# EAGLE schematic SensorShield-Smoke (EAGLE 6.6.0)
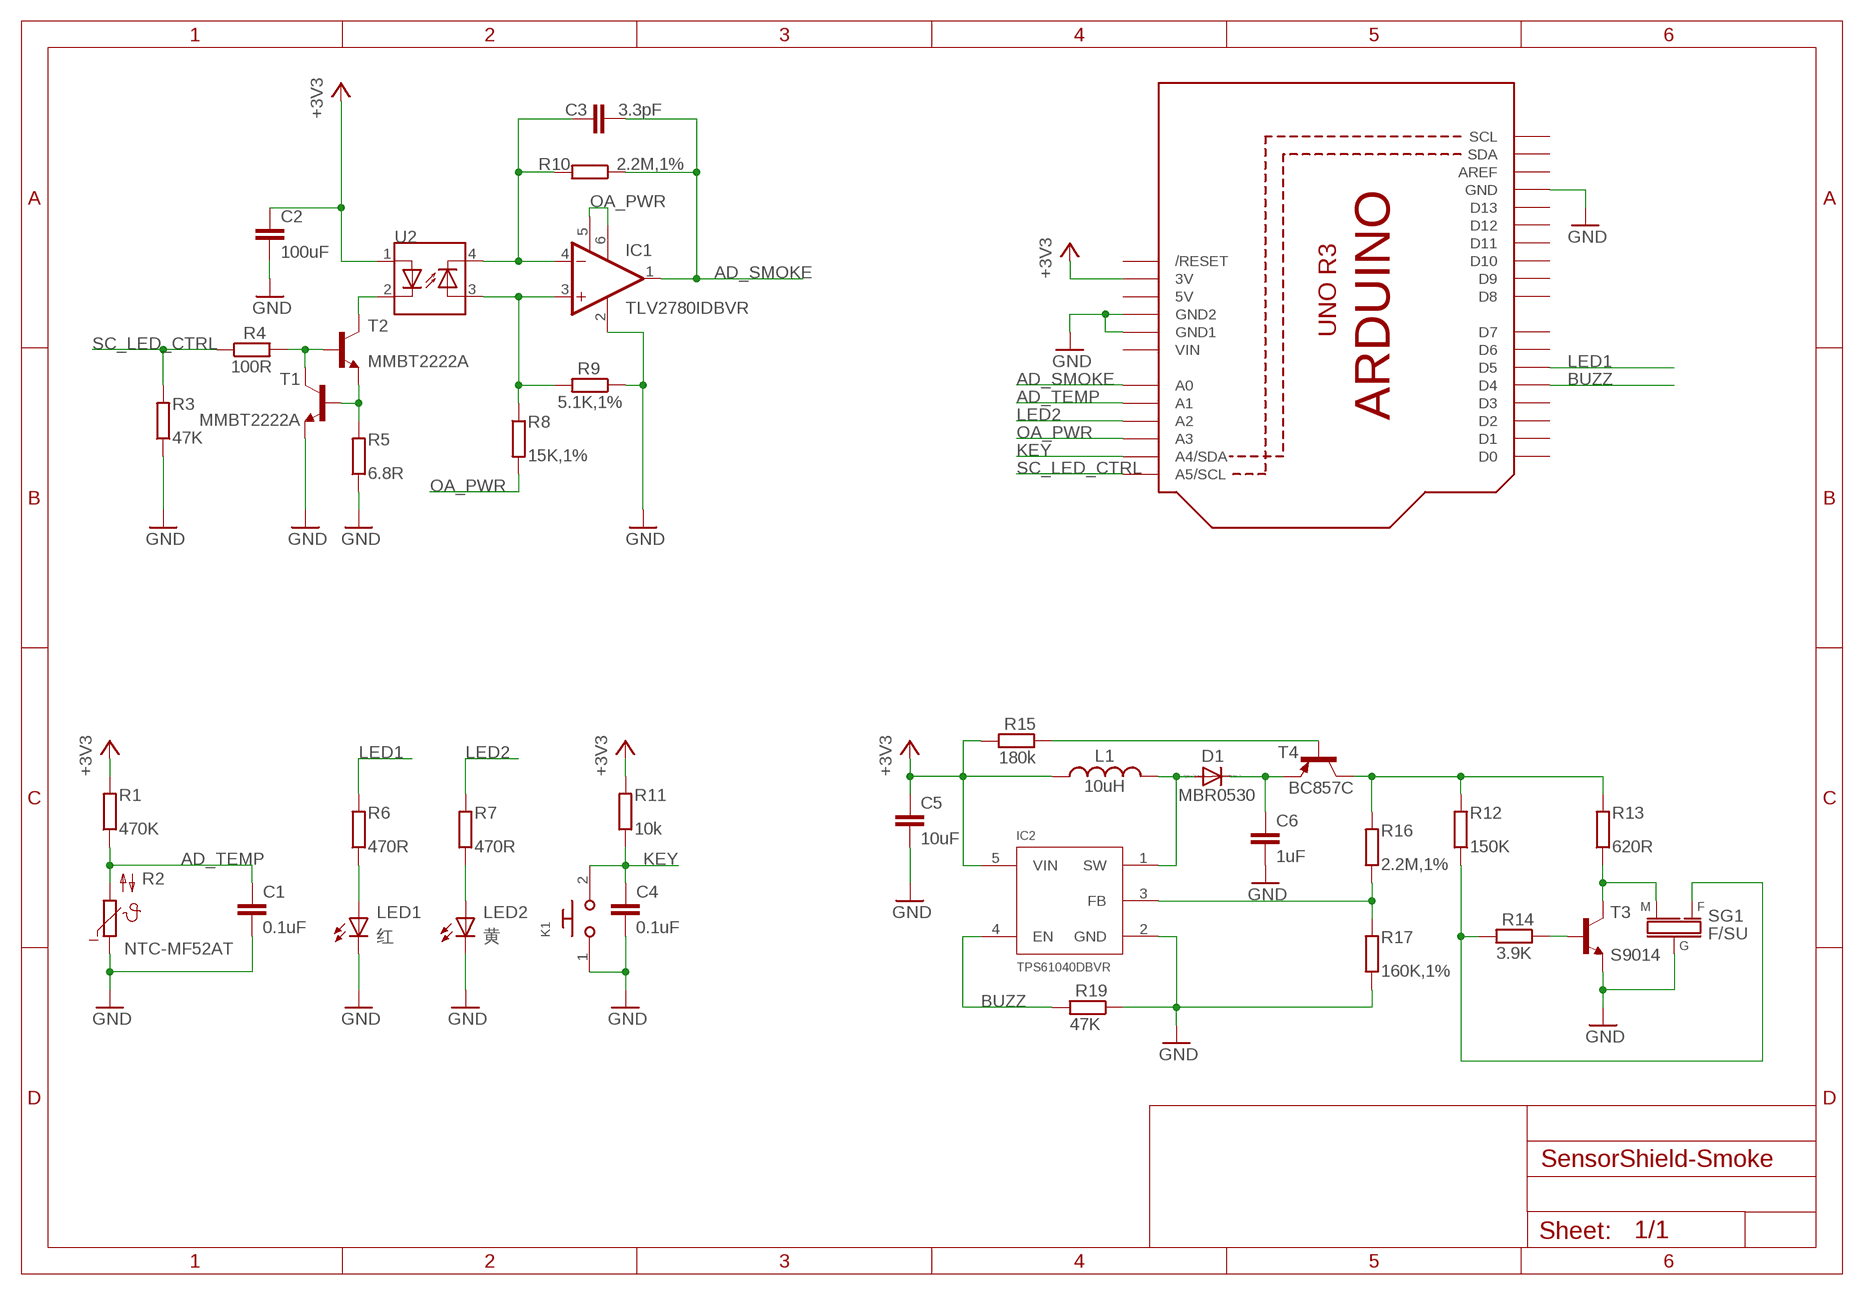
[diagram p0: schematic, sheet 1]

## Parts
C1  0.1uF  C-EUC0805  [C0805]
C2  100uF  C-EUC1210  [C1210]
C3  3.3pF  C-EUC0805  [C0805]
C4  0.1uF  C-EUC0805  [C0805]
C5  10uF  C-EUC0805  [C0805]
C6  1uF  C-EUC0805  [C0805]
D1  MBR0530  DIODE-SOD123  [SOD123]
IC1  TLV2780IDBVR  [SOT23-6]
IC2  TPS61040DBVR  [DBV0005A]
K1  MYLIBRARY_MICRO_SWITCH  [MYLIBRARY_MICROSWITCH]
L1  10uH  L-USL3216C  [L3216C]
LED1  红  LEDSML0805  [SML0805]
LED2  黄  LEDSML0805  [SML0805]
Q1  ARDUINOR3-NOIOREF-NOTEXT  [ARDUINOR3-NOTEXT-NOIOREF]
R1  470K  R-EU_R0805  [R0805]
R2  NTC-MF52AT  NTC640  [P640]
R3  47K  R-EU_R0805  [R0805]
R4  100R  R-EU_R0805  [R0805]
R5  6.8R  R-EU_R0805  [R0805]
R6  470R  R-EU_R0805  [R0805]
R7  470R  R-EU_R0805  [R0805]
R8  15K,1%  R-EU_R0805  [R0805]
R9  5.1K,1%  R-EU_R0805  [R0805]
R10  2.2M,1%  R-EU_R0805  [R0805]
R11  10k  R-EU_R0805  [R0805]
R12  150K  R-EU_R0805  [R0805]
R13  620R  R-EU_R0805  [R0805]
R14  3.9K  R-EU_R0805  [R0805]
R15  180k  R-EU_R0805  [R0805]
R16  2.2M,1%  R-EU_R0805  [R0805]
R17  160K,1%  R-EU_R0805  [R0805]
R19  47K  R-EU_R0805  [R0805]
SG1  F/SU  [F/SU]
T1  MMBT2222A  MMBT2222ALT1-NPN-SOT23-BEC  [SOT23-BEC]
T2  MMBT2222A  MMBT2222ALT1-NPN-SOT23-BEC  [SOT23-BEC]
T3  S9014  BC847C-NPN-SOT23-BEC  [SOT23-BEC]
T4  BC857C  BC857C-PNP-SOT23-BEC  [SOT23-BEC]
U2  SMOKE-CHAMBER6-131  [6-131]

## Nets
+3V3: C2.1 C5.1 IC2.5(VIN) L1.1 Q1.3V R1.2 R11.2 R15.2 U2.1(A)
AD_SMOKE: C3.1 IC1.1(OUT) Q1.A0 R10.1
AD_TEMP: C1.1 Q1.A1 R1.1 R2.2
BUZZ: IC2.4(EN) Q1.D4 R19.2
F: R12.1 R14.2 SG1.1(F)
GND: C1.2 C2.2 C4.2 C5.2 C6.2 IC1.2(V-) IC2.2(GND) K1.1 LED1.C LED2.C Q1.GND Q1.GND1 Q1.GND2 R2.1 R3.1 R5.1 R9.1 R17.1 R19.1 SG1.3(G) T1.E T3.E
KEY: C4.1 K1.2 Q1.A4(A4/SDA) R11.1
LED1: Q1.D5 R6.2
LED2: Q1.A2 R7.2
M: R13.1 SG1.2(M) T3.C
N$1: C3.2 IC1.4(-IN) R10.2 U2.4(C1)
N$2: IC1.3(+IN) R8.1 R9.2 U2.3(A1)
N$4: LED1.A R6.1
N$5: R4.2 T1.C T2.B
N$6: R5.2 T1.B T2.E
N$7: T2.C U2.2(C)
N$9: D1.A IC2.1(SW) L1.2
N$10: R14.1 T3.B
N$12: LED2.A R7.1
N$13: C6.1 D1.C T4.E
N$14: IC2.3(FB) R16.1 R17.2
N$15: R12.2 R13.2 R16.2 T4.C
N$16: R15.1 T4.B
OA_PWR: IC1.5(!SHDN) IC1.6(V+) Q1.A3 R8.2
SC_LED_CTRL: Q1.A5(A5/SCL) R3.2 R4.1
Unconnected: Q1.AREF Q1.D0 Q1.D1 Q1.D2 Q1.D3 Q1.D6 Q1.D7 Q1.D8 Q1.D9 Q1.D10 Q1.D11 Q1.D12 Q1.D13 Q1.RESET(/RESET) Q1.SCL Q1.SDA

## Power pins joined to a net without a drawn wire
5V: Q1.5V
VIN: Q1.VIN

## Library data of the parts
C1-C6 = rcl:C-EU: CAPACITOR, European symbol
D1 = diode:DIODE-: DIODE
IC1 = MyLibrary:TLV2780IDBVR: 具有关断状态的单路 1.8V RRIO 8MHz 放大器
IC2 = MyLibrary:TPS61040DBVR; COMPTYPE: IC; MANUFACTURER: Texas Instruments; MOUNTTYPE: SMT; PACKAGEREFERENCE: DBV0005A; PARTNUMBER: TPS61040DBVR; PIN_COUNT: 5; REFDES: RefDes; ROHS: Y; SYMBOLVERISON: 2014-09-09; TYPE: TYPE; VALUE: Value
K1 = SpeexVocoder:MYLIBRARY_MICRO_SWITCH: MICRO_SWITCH
L1 = rcl:L-US: INDUCTOR, American symbol
LED1 LED2 = led:LED: LED OSRAM: - CHIPLED LG R971, LG N971, LY N971, LG Q971, LY Q971, LO R971, LY R971 LH N974, LH R974 LS Q976, LO Q976, LY Q976 LO Q996 - Hyper CHIPLED LW Q18S LB Q993, LB Q99A, LB R99A - SideLED LS A670, LO A670, LY A670, LG A670, LP A670 LB A673, LV A673, LT A673, LW A673 LH A674 LY A675 LS A676, LA A676, LO A676, LY A676, LW A676 LS A679, LY A679, LG A679 - Hyper Micro SIDELED® LS Y876, LA Y876, LO Y876, LY Y876 LT Y87S - SmartLED LW L88C, LW L88S LB L89C, LB L89S, LG L890 LS L89K, LO L89K, LY L89K LS L896, LA L896, LO L896, LY L896 - TOPLED LS T670, LO T670, LY T670, LG T670, LP T670 LSG T670, LSP T670, LSY T670, LOP T670, LYG T670 LG T671, LOG T671, LSG T671 LB T673, LV T673, LT T673, LW T673 LH T674 LS T676, LA T676, LO T676, LY T676, LB T676, LH T676, LSB T676, LW T676 LB T67C, LV T67C, LT T67C, LS T67K, LO T67K, LY T67K, LW E67C LS E67B, LA E67B, LO E67B, LY E67B, LB E67C, LV E67C, LT E67C LW T67C LS T679, LY T679, LG T679 LS T770, LO T770, LY T770, LG T770, LP T770 LB T773, LV T773, LT T773, LW T773 LH T774 LS E675, LA E675, LY E675, LS T675 LS T776, LA T776, LO T776, LY T776, LB T776 LHGB T686 LT T68C, LB T68C - Hyper Mini TOPLED® LB M676 - Mini TOPLED Santana® LG M470 LS M47K, LO M47K, LY M47K Source: http://www.osram.convergy.de LUXEON: - LUMILED® LXK2-PW12-R00, LXK2-PW12-S00, LXK2-PW14-U00, LXK2-PW14-V00 LXK2-PM12-R00, LXK2-PM12-S00, LXK2-PM14-U00 LXK2-PE12-Q00, LXK2-PE12-R00, LXK2-PE12-S00, LXK2-PE14-T00, LXK2-PE14-U00 LXK2-PB12-K00, LXK2-PB12-L00, LXK2-PB12-M00, LXK2-PB14-N00, LXK2-PB14-P00, LXK2-PB14-Q00 LXK2-PR12-L00, LXK2-PR12-M00, LXK2-PR14-Q00, LXK2-PR14-R00 LXK2-PD12-Q00, LXK2-PD12-R00, LXK2-PD12-S00 LXK2-PH12-R00, LXK2-PH12-S00 LXK2-PL12-P00, LXK2-PL12-Q00, LXK2-PL12-R00 Source: www.luxeon.com KINGBRIGHT: KA-3528ASYC Source: www.kingbright.com
Q1 = adafruit:ARDUINOR3-NOIOREF
R1 R3-R17 R19 = rcl:R-EU_: RESISTOR, European symbol
R2 = ptc-ntc:NTC640: PHILIPS NTC; OC_FARNELL: unknown; OC_NEWARK: unknown
SG1 = MyLibrary:F/SU: BUZZER Source: Spoerle
T1-T3 = transistor:*-NPN-: NPN Transistror BF959 corrected 2008.03.06
T4 = transistor-neu-to92:*-PNP-: PNP Transistror
U2 = MyLibrary:SMOKE-CHAMBER: 1201烟雾迷宫